# EAGLE design M8-Eval-Adapter (EAGLE 9.5.2)
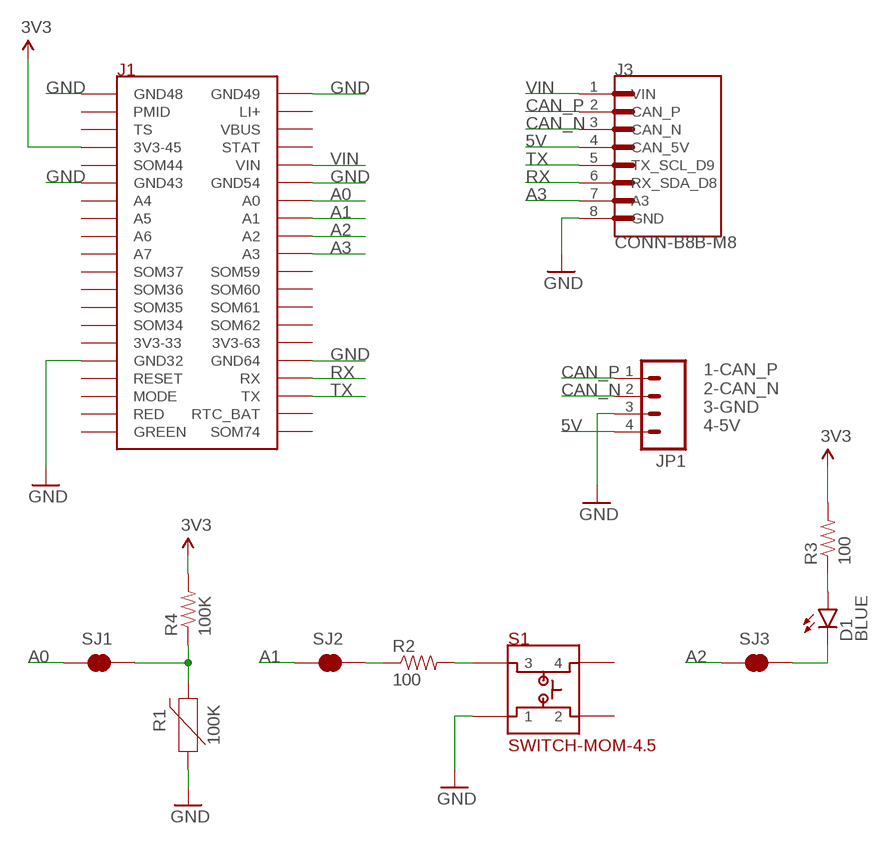
[diagram p0: schematic, sheet 1]

## Parts
D1  BLUE  LED-BLUE0603  [LED-0603]
J1  HDR-TRACKER-EVAL-MAIN  [HDR-TRACKER-EVAL-MAIN]
J3  CONN-B8B-M8  [JST_B8B-PH-SM4-TB(LF)(SN)]
JP1  M04PTH  [1X04]
R1  100K  NTC-THERMISTOR-0603  [0603]
R2  100  RES-100-0603.DEV  [0603-RES]
R3  100  RES-100-0603.DEV  [0603-RES]
R4  100K  RES-100K-0603  [0603-RES]
S1  SWITCH-MOM-4.5  [SWITCH-MOM-4.5]
SJ1  JUMPER-PAD-2-NC_BY_TRACENO_SILK  [PAD-JUMPER-2-NC_BY_TRACE_NO_SILK]
SJ2  JUMPER-PAD-2-NC_BY_TRACENO_SILK  [PAD-JUMPER-2-NC_BY_TRACE_NO_SILK]
SJ3  JUMPER-PAD-2-NC_BY_TRACENO_SILK  [PAD-JUMPER-2-NC_BY_TRACE_NO_SILK]

## Nets
3V3: J1.3V3-45 R3.2 R4.2
5V: J3.4(CAN_5V) JP1.4
A0: J1.A0 SJ1.1
A1: J1.A1 SJ2.1
A2: J1.A2 SJ3.1
A3: J1.A3 J3.7(A3)
CAN_N: J3.3(CAN_N) JP1.2
CAN_P: J3.2(CAN_P) JP1.1
GND: J1.GND32 J1.GND43 J1.GND48 J1.GND49 J1.GND54 J1.GND64 J3.8(GND) JP1.3 R1.1 S1.1
N$1: R2.1 SJ2.2
N$2: R1.2 R4.1 SJ1.2
N$3: R2.2 S1.3
N$5: D1.C SJ3.2
N$6: D1.A R3.1
RX: J1.RX J3.6(RX_SDA_D8)
TX: J1.TX J3.5(TX_SCL_D9)
VIN: J1.VIN J3.1(VIN)
Unconnected: J1.3V3-33 J1.3V3-63 J1.A4 J1.A5 J1.A6 J1.A7 J1.GREEN J1.LI+ J1.MODE J1.PMID J1.RED J1.RESET J1.RTC_BAT J1.SOM34 J1.SOM35 J1.SOM36 J1.SOM37 J1.SOM44 J1.SOM59 J1.SOM60 J1.SOM61 J1.SOM62 J1.SOM75(SOM74) J1.STAT J1.TS J1.VBUS S1.2 S1.4

## Notes on the sheet
- 1-CAN_P
  2-CAN_N
  3-GND
  4-5V

## Library data of the parts
D1 = rickk2:LED-BLUE: Lite-On LTST-C193TBKT-5A 0603 clear lens 6.25 mcd 130° viewing 15 mcd 5mA @ 2.8V $0.47 Blue 470nm LED Indication - Discrete 2.8V 0603 (1608 Metric) https://www.digikey.com/product-detail/en/lite-on-inc/LTST-C193TBKT-5A/160-1827-1-ND/2355044 R = 100 ohms @ 3.3V Stripe is on the anode (+) side on the bottom side!
J1 = rickk2:HDR-TRACKER-EVAL-MAIN
J3 = rickk2:CONN-B8B-M8: PH Series 2 mm Pitch 12 Position SMT Single Row Top Entry Shrouded Header
JP1 = rickk2:M04: Header 4 Standard 4-pin 0.1" header. Use with straight break away headers (SKU : PRT-00116), right angle break away headers (PRT-00553), swiss pins (PRT-00743), machine pins (PRT-00117), and female headers (PRT-00115). Molex polarized connector foot print use with SKU : PRT-08231 with associated crimp pins and housings. 1MM SMD Version SKU: PRT-10208
R1 = rickk2:NTC-THERMISTOR: NTC Thermistor An NTC thermistor's resistance decreases as temperature rises. Applications: Resistance Thermometer - temperature monitoring Inrush current limiter Heat source; PROD_ID: RES-13608; VALUE: 10k
R2 R3 = rickk2:RES-100-0603.DEV: RES SMD 100 OHM 5% 1/10W 0603 $ 0.10 ±5% 0.1W, 1/10W Chip Resistor 0603 (1608 Metric) Automotive AEC-Q200 Thick Film https://www.digikey.com/product-detail/en/panasonic-electronic-components/ERJ-3GEYJ101V/P100GCT-ND/134714
R4 = rickk2:RES-100K-0603: 100 kOhms ±1% 0.1W, 1/10W Chip Resistor 0603 (1608 Metric) Automotive AEC-Q200 Thick Film https://www.digikey.com/product-detail/en/panasonic-electronic-components/ERJ-3EKF1003V/P100KHCT-ND/198110 Old: RES SMD 100K OHM 1% 1/4W 0603 $ 0.16 Panasonic ERJ-PA3F1003V ±1% 0.25W, 1/4W Chip Resistor 0603 (1608 Metric) Automotive AEC-Q200, Pulse Withstanding Thick Film https://www.digikey.com/product-detail/en/panasonic-electronic-components/ERJ-PA3F1003V/P100KBYCT-ND/5036116
S1 = rickk2:SWITCH-MOM-4.5: Manufacturer: E-Switch Manufacturer Part Number: TL3305AF160QG Description: SWITCH TACTILE SPST-NO 50MA 12V Detailed Description: Tactile Switch SPST-NO Top Actuated Surface Mount $0.20 https://www.digikey.com/product-detail/en/e-switch/TL3305AF160QG/EG5350CT-ND/5816195
SJ1-SJ3 = rickk2:JUMPER-PAD-2-NC_BY_TRACE

## Board
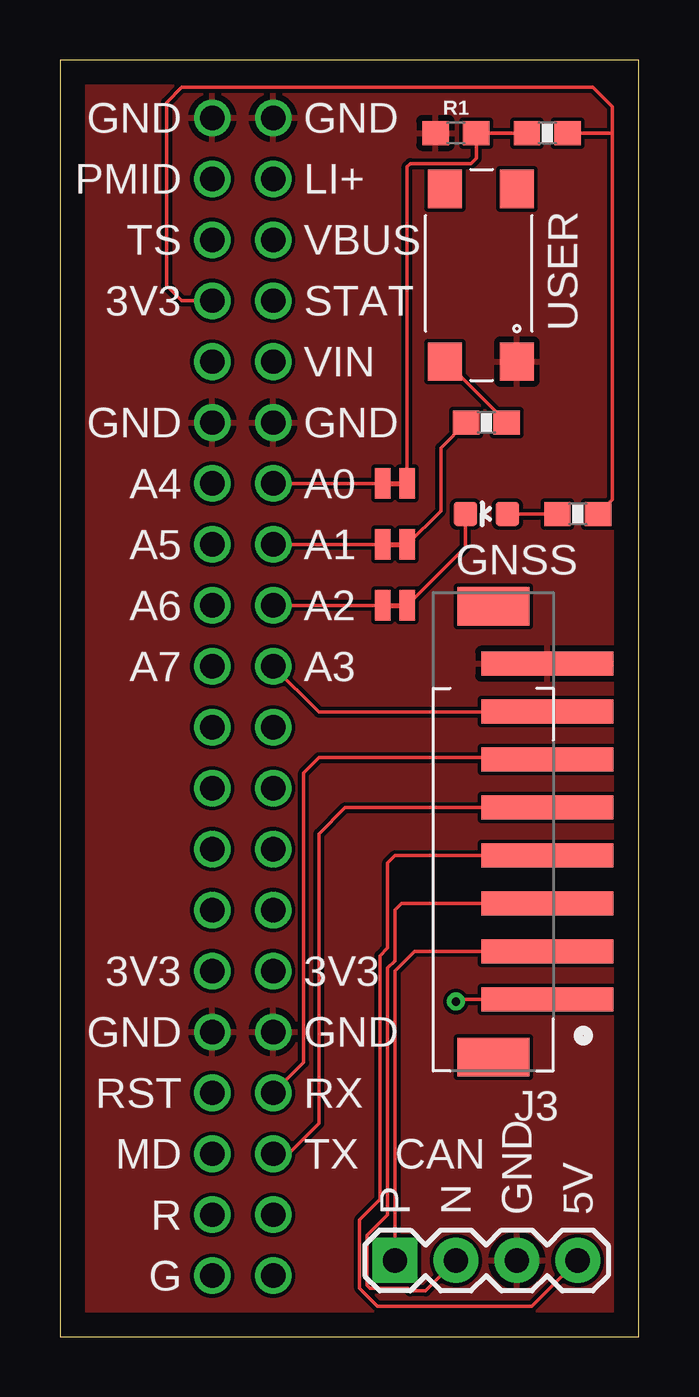
[diagram p1: board, top side]
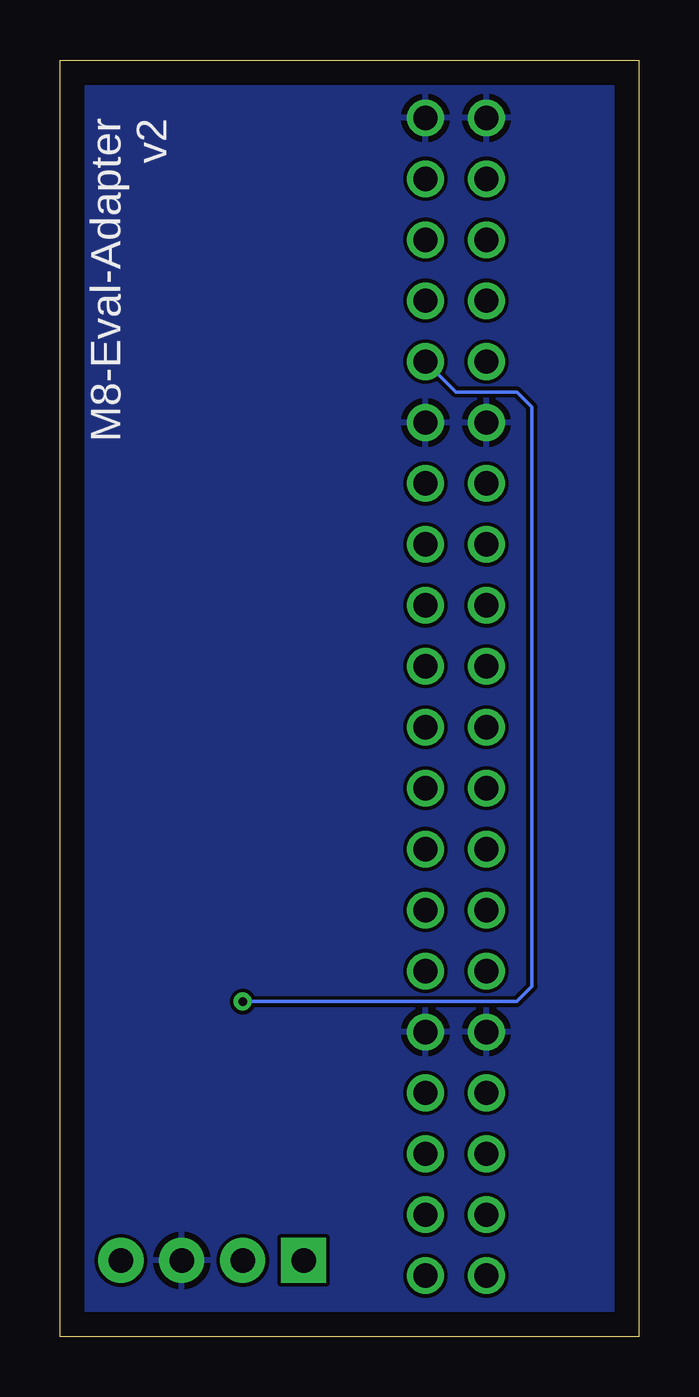
[diagram p2: board, bottom side, seen from below]

Size 24.13 x 53.21 mm. Coordinates in mm from the lower left corner, seen from the top.
Outline: 0,0 24.13,0 24.13,53.19 0,53.21 0,0
Copper layers (1*16): Top 0.035mm / dielectric 1.5mm / Bottom 0.035mm
Design rules "default": minimum track width 6mil, minimum drill 0.35mm, track to track 6mil, track to pad 6mil, pad to pad 6mil, via to via 6mil, smd to smd 6mil, copper to edge 40mil, drill to drill 6mil, minimum pad ring 10mil, minimum via ring 8mil, stop-mask expansion 4mil, vias tented up to drill 0mil, thermal gap 10mil

### Footprints (pad centres in the part's own frame; a part is rotated, then mirrored left to right if it is on the bottom)
LED-0603 = smd 1 x 1: A 0,-0.877; C 0,0.877
HDR-TRACKER-EVAL-MAIN = drill 1.016: 3V3-33 0,12.7; 3V3-45 0,40.64; 3V3-63 2.54,12.7; A0 2.54,33.02; A1 2.54,30.48; A2 2.54,27.94; A3 2.54,25.4; A4 0,33.02; A5 0,30.48; A6 0,27.94; A7 0,25.4; GND32 0,10.16; GND43 0,35.56; GND48 0,48.26; GND49 2.54,48.26; GND54 2.54,35.56; GND64 2.54,10.16; GREEN 0,0; LI+ 2.54,45.72; MODE 0,5.08; PMID 0,45.72; RED 0,2.54; RESET 0,7.62; RTC_BAT 2.54,2.54; RX 2.54,7.62; SOM34 0,15.24; SOM35 0,17.78; SOM36 0,20.32; SOM37 0,22.86; SOM44 0,38.1; SOM59 2.54,22.86; SOM60 2.54,20.32; SOM61 2.54,17.78; SOM62 2.54,15.24; SOM75 2.54,0; STAT 2.54,40.64; TS 0,43.18; TX 2.54,5.08; VBUS 2.54,43.18; VIN 2.54,38.1
JST_B8B-PH-SM4-TB(LF)(SN) = smd 1 x 5.5: 1 -5,0; 2 -3,0; 3 -1,0; 4 1,0; 5 3,0; 6 5,0; 7 7,0; 8 9,0 | smd 1.6 x 3: P1 -7.4,2.25; P2 11.4,2.25
1X04 = drill 1.016 pad 1.88 square: 1 0,0 | drill 1.016 pad 1.88: 2 2.54,0; 3 5.08,0; 4 7.62,0
0603 = smd 1.1 x 1: 1 -0.85,0; 2 0.85,0
0603-RES = smd 1.1 x 1: 1 -0.85,0; 2 0.85,0
SWITCH-MOM-4.5 = smd 1.6 x 1.4: 1 0,0; 2 7.2,0; 3 0,3; 4 7.2,3
PAD-JUMPER-2-NC_BY_TRACE_NO_SILK = smd 0.635 x 1.27: 1 -0.508,0; 2 0.508,0

### Placement (x,y rotation side)
D1  17.78,34.29 90 top
J1  6.35,2.54 0 top
J3  20.32,19.05 90 top
JP1  13.97,3.17 0 top
R1  16.51,50.16 0 top
R2  17.78,38.1 0 top
R3  21.59,34.29 0 top
R4  20.32,50.16 0 top
S1  19.05,40.64 90 top
SJ1  13.97,35.56 0 top
SJ2  13.97,33.02 0 top
SJ3  13.97,30.48 0 top

### Tracks (layer width: path | path; a pad name or v marks a point on that pad's centre or on a via)
3V3
  Top 0.152: J1.3V3-45 5.08,43.18 4.45,43.81 4.45,51.44 5.08,52.07 22.23,52.07 23.04,51.26 23.04,50.16 | R3.2 23.04,34.89 23.04,50.16 | R4.2 23.04,50.16
5V
  Top 0.152: JP1.4 19.68,1.27 13.24,1.27 12.5,2.01 12.5,4.88 13.34,5.71 13.34,15.88 13.66,16.2 13.66,19.75 13.97,20.05 J3.4
A0
  Top 0.152: SJ1.1 J1.A0
A1
  Top 0.152: SJ2.1 J1.A1
A2
  Top 0.152: SJ3.1 J1.A2
A3
  Top 0.152: J1.A3 10.79,26.04 20.3,26.04 J3.7
CAN_N
  Top 0.152: JP1.2 15.24,1.91 14.61,1.91 14.5,2.01 12.94,2.01 12.8,2.14 12.8,4.22 13.66,5.08 13.66,15.37 13.97,15.67 13.97,17.78 14.24,18.05 J3.3
CAN_P
  Top 0.152: J3.2 14.78,16.05 13.97,15.24 JP1.1
GND
  pour Top: 0,-2.54 0,53.34 43.18,53.34 43.18,-2.54
  pour Bottom: 0,-1.27 0,54.61 41.91,54.61 41.91,-1.27
N$1
  Top 0.152: SJ2.2 15.88,34.42 15.88,37.05 R2.1
N$2
  Top 0.152: R4.1 R1.2 17.36,49.11 17.14,48.9 14.61,48.9 14.48,48.77 SJ1.2
N$3
  Top 0.152: S1.3 16.09,40.64 R2.2
N$5
  Top 0.152: SJ3.2 16.9,32.91 D1.C
N$6
  Top 0.152: D1.A R3.1
RX
  Top 0.152: J1.RX 10.16,11.43 10.16,23.5 10.79,24.13 20.24,24.13 J3.6
TX
  Top 0.152: J1.TX 9.53,7.62 10.79,8.89 10.79,20.95 11.89,22.05 J3.5
VIN  (via drill 0.35)
  Top 0.152: v16.51,13.97 16.59,14.05 J3.1
  Bottom 0.152: v16.51,13.97 5.08,13.97 4.45,14.61 4.45,38.73 5.08,39.37 7.62,39.37 J1.VIN

### Text on the board
tPlace: USER | GNSS | CAN | P | N | GND | 5V
bPlace: M8-Eval-Adapter / v2